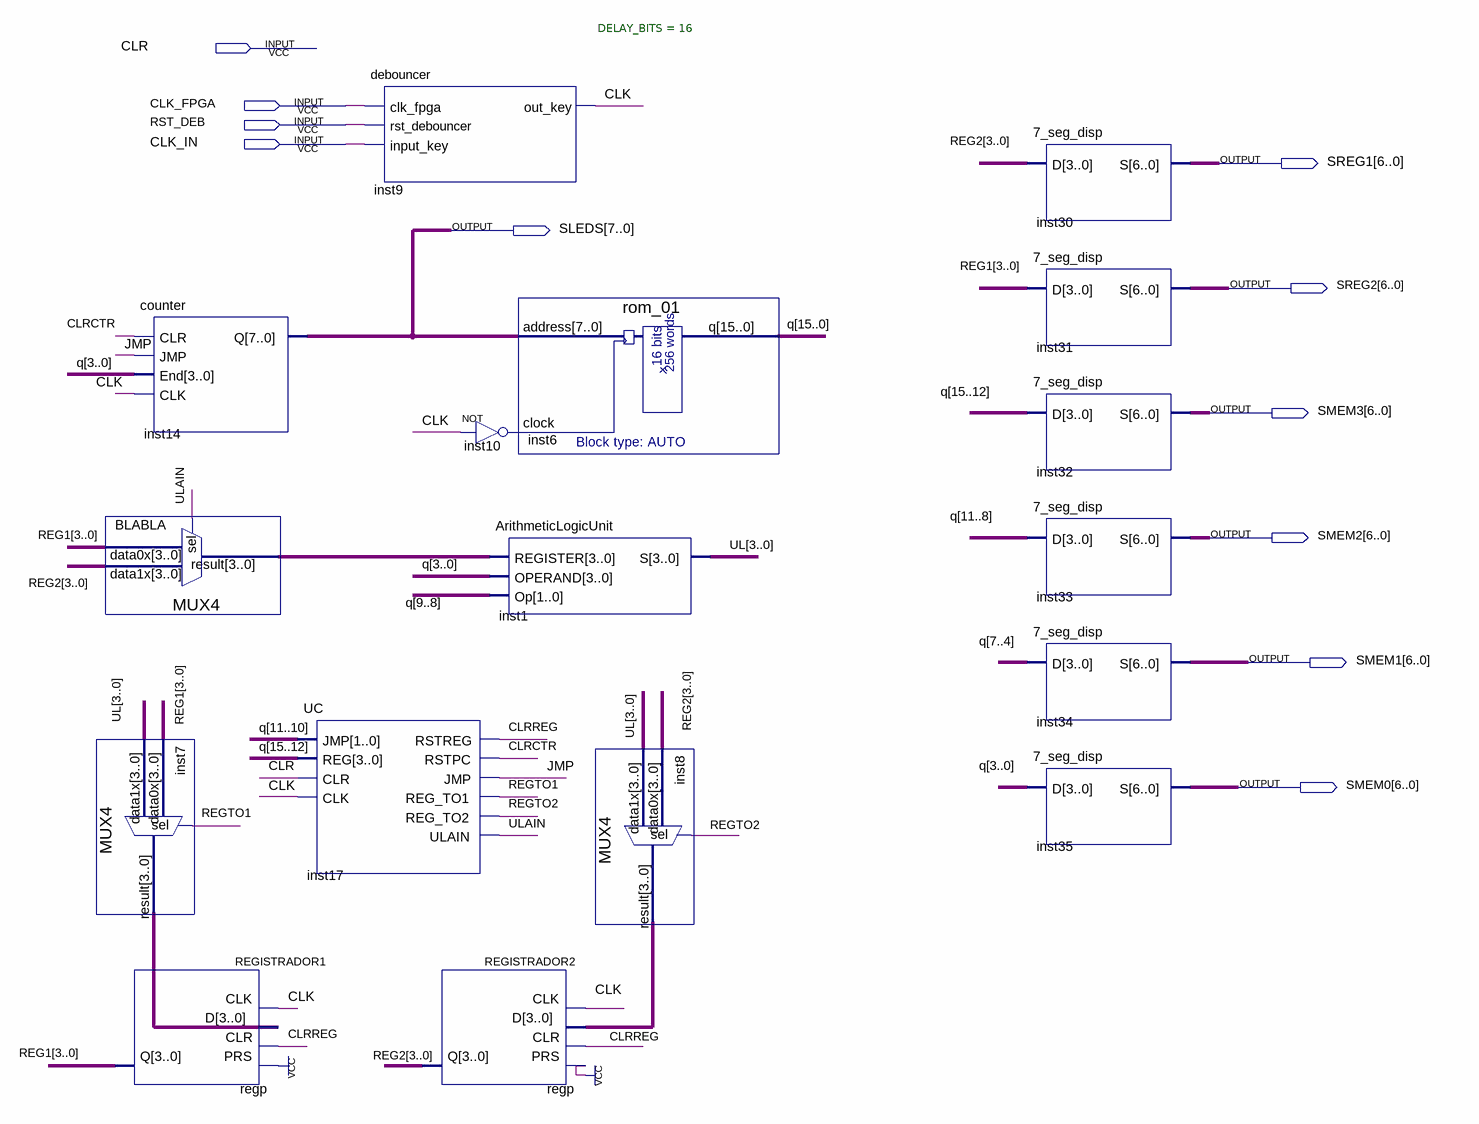
[diagram p0: schematic sheet]
// Quartus schematic CPU.bdf as structural Verilog: 17 symbols, 11 pins
module CPU (
  input  CLR,
  input  CLK_FPGA,
  input  RST_DEB,
  input  CLK_IN,
  output [6:0] SREG1,
  output [7:0] SLEDS,
  output [6:0] SREG2,
  output [6:0] SMEM3,
  output [6:0] SMEM2,
  output [6:0] SMEM1,
  output [6:0] SMEM0
);

  wire CLK, CLRCTR, CLRREG, inst10_out, JMP, REGTO1, REGTO2, ULAIN;
  wire [3:0] BLABLA_result, inst7_result, inst8_result, REG1, REG2, UL;
  wire [15:0] q;

  counter inst14 (.CLR(CLRCTR), .JMP(JMP), .End(q[3:0]), .CLK(CLK), .Q(SLEDS));
  MUX4 BLABLA (.data1x(REG2), .data0x(REG1), .sel(ULAIN), .result(BLABLA_result));
  MUX4 inst7 (.data1x(UL), .data0x(REG1), .sel(REGTO1), .result(inst7_result));
  regp REGISTRADOR1 (.PRS(1'b1), .CLR(CLRREG), .D(inst7_result), .CLK(CLK), .Q(REG1));
  debouncer #(.DELAY_BITS(16)) inst9 (.clk_fpga(CLK_FPGA), .rst_debouncer(RST_DEB), .input_key(CLK_IN), .out_key(CLK));
  UC inst17 (
    .JMP({q[11:10], JMP}), .REG(q[15:12]), .CLR(CLR), .CLK(CLK), .RSTREG(CLRREG), .RSTPC(CLRCTR),
    .REG_TO1(REGTO1), .REG_TO2(REGTO2), .ULAIN(ULAIN));
  regp REGISTRADOR2 (.PRS(1'b1), .CLR(CLRREG), .D(inst8_result), .CLK(CLK), .Q(REG2));
  rom_01 inst6 (.address(SLEDS), .clock(inst10_out), .q(q));
  not inst10 (inst10_out, CLK);
  ArithmeticLogicUnit inst1 (.REGISTER(BLABLA_result), .OPERAND(q[3:0]), .Op(q[9:8]), .S(UL));
  MUX4 inst8 (.data1x(UL), .data0x(REG2), .sel(REGTO2), .result(inst8_result));
  \7_seg_disp  inst30 (.D(REG2), .S(SREG1));
  \7_seg_disp  inst31 (.D(REG1), .S(SREG2));
  \7_seg_disp  inst32 (.D(q[15:12]), .S(SMEM3));
  \7_seg_disp  inst33 (.D(q[11:8]), .S(SMEM2));
  \7_seg_disp  inst34 (.D(q[7:4]), .S(SMEM1));
  \7_seg_disp  inst35 (.D(q[3:0]), .S(SMEM0));
endmodule
